# EAGLE design controller (EAGLE 6.5.0)
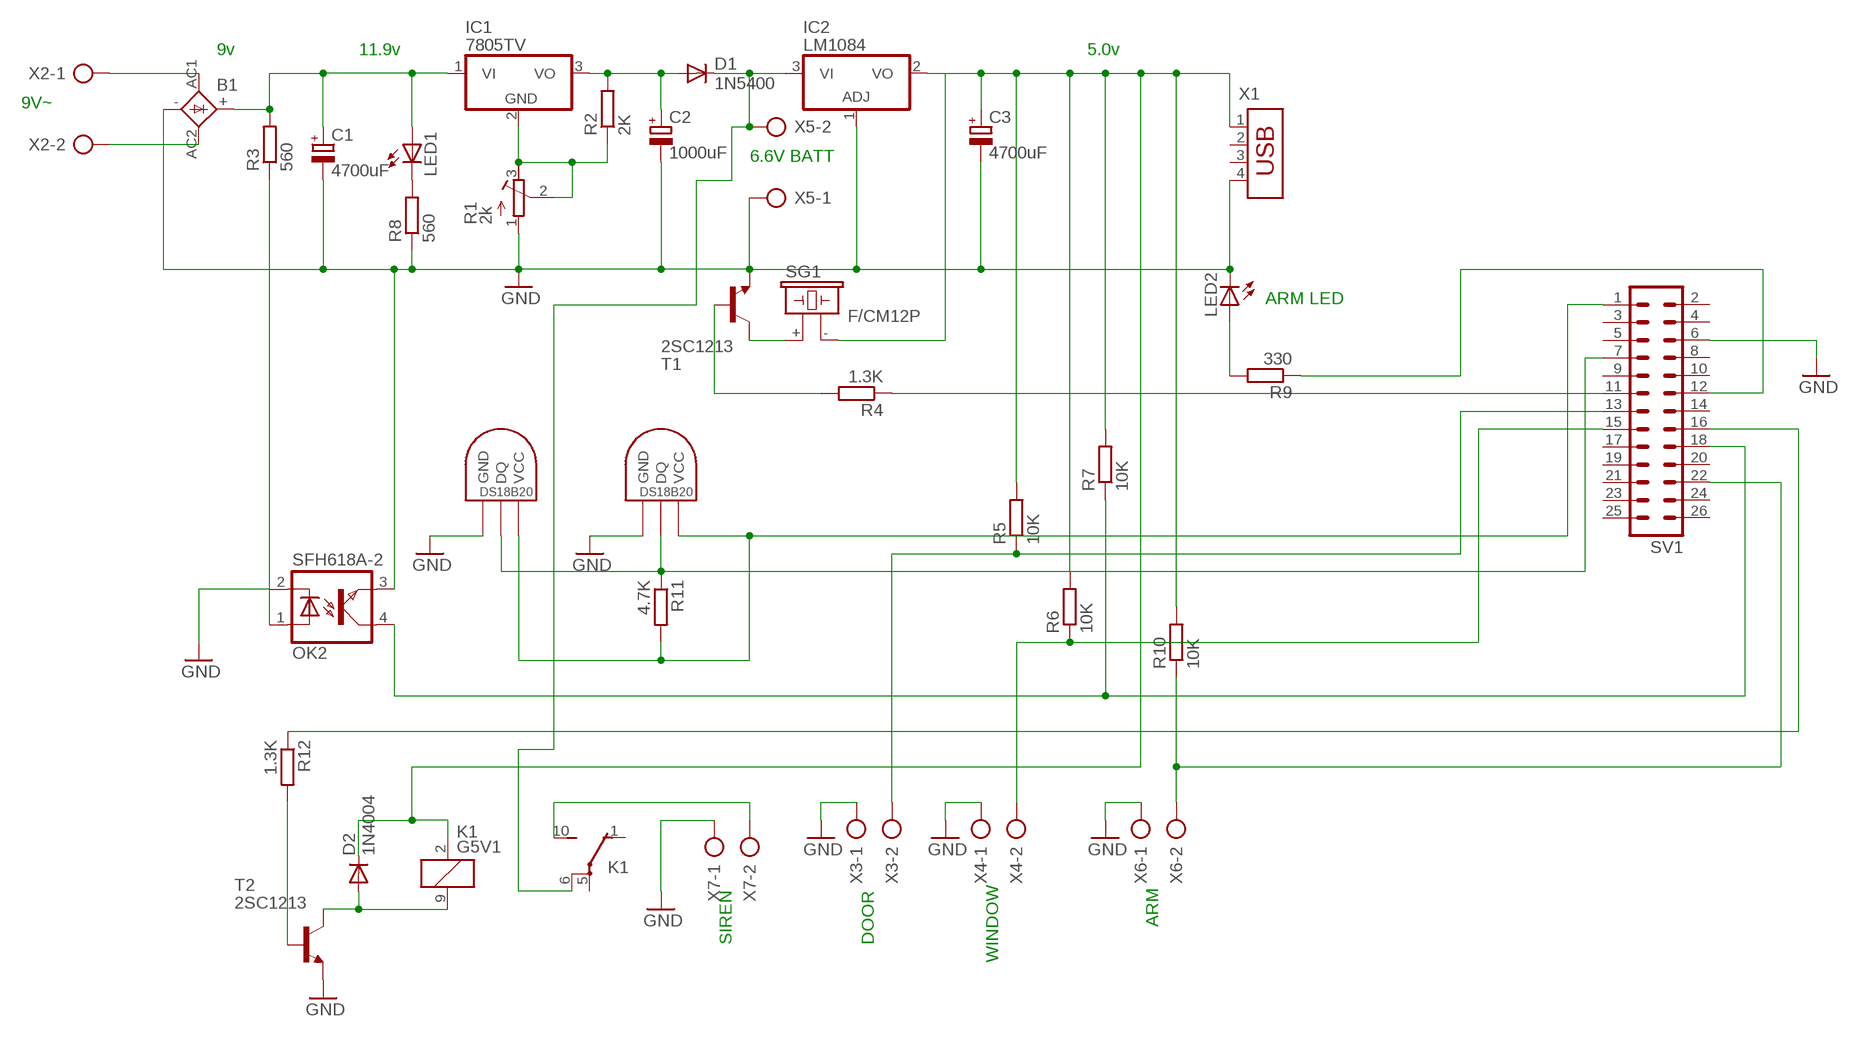
[diagram p0: schematic, sheet 1]

## Parts
B1  S41  [S41]
C1  4700uF  CPOL-EUE5-13  [E5-13]
C2  1000uF  CPOL-EUE5-10.5  [E5-10,5]
C3  4700uF  CPOL-EUE5-13  [E5-13]
D1  1N5400  [DO201-15]
D2  1N4004  [DO41-10]
IC1  7805TV  [TO220V]
IC2  LM1084  MC33269T-5.0  [TO220V]
K1  G5V1  [G5V1]
LED1  LED5MM  [LED5MM]
LED2  LED5MM  [LED5MM]
OK2  SFH618A-2  [DIP4]
R1  2k  R-TRIMM64W  [RTRIM64W]
R2  2K  R-EU_0204/7  [0204/7]
R3  560  R-EU_0204/7  [0204/7]
R4  1.3K  R-EU_0204/7  [0204/7]
R5  10K  R-EU_0204/7  [0204/7]
R6  10K  R-EU_0204/7  [0204/7]
R7  10K  R-EU_0204/7  [0204/7]
R8  560  R-EU_0204/7  [0204/7]
R9  330  R-EU_0204/7  [0204/7]
R10  10K  R-EU_0204/7  [0204/7]
R11  4.7K  R-EU_0204/7  [0204/7]
R12  1.3K  R-EU_0204/7  [0204/7]
SG1  F/CM12P  [F/CM12P]
SV1  ML26L  [ML26L]
T1  2SC1213  -NPN-TO92-EBC  [TO92-EBC]
T2  2SC1213  -NPN-TO92-EBC  [TO92-EBC]
U$1  DS1820TO92  [DS1820]
U$2  DS1820TO92  [DS1820]
X1  USB-787616  [USB]
X2  AK500/2  [AK500/2]
X3  AK500/2  [AK500/2]
X4  AK500/2  [AK500/2]
X5  AK500/2  [AK500/2]
X6  AK500/2  [AK500/2]
X7  AK500/2  [AK500/2]

## Nets
GND [fat]: B1.- C1.- C2.- C3.- IC2.1(ADJ) LED2.K(C) OK2.2(C) OK2.3(EMIT) R1.1(E) R8.1 SV1.6 T1.E T2.E U$1.GND U$2.GND X1.4 X3.1 X4.1 X5.1 X6.1 X7.1
N$1: IC1.2(GND) R1.2(S) R1.3(A) R2.1
N$2: R12.2 T2.B
N$3 [fat]: D2.A K1.9 T2.C
N$4 [fat]: C2.+ D1.A IC1.3(VO) R2.2
N$5 [fat]: B1.AC2 X2.2
N$6 [fat]: B1.AC1 X2.1
N$7 [fat]: B1.+ C1.+ IC1.1(VI) LED1.A R3.2
N$8: OK2.1(A) R3.1
N$9: OK2.4(COL) R7.1 SV1.18
N$10: R4.2 T1.B
N$11: R4.1 SV1.11
N$12: SG1.+ T1.C
N$13: R5.1 SV1.13 X3.2
N$14: LED1.K(C) R8.2
N$15: R6.1 SV1.15 X4.2
N$16: LED2.A R9.2
N$17: R9.1 SV1.12
N$18: R10.1 SV1.22 X6.2
N$19: R11.1 SV1.7 U$1.DQ U$2.DQ
N$20: R11.2 SV1.1 U$1.VDD(VCC) U$2.VDD(VCC)
N$21: R12.1 SV1.16
N$22 [fat]: C3.+ D2.C IC2.2(VO) K1.2 R5.2 R6.2 R7.2 R10.2 SG1.- X1.1
N$23: K1.10(2:S) X7.2
N$24 [fat]: D1.C IC2.3(VI) K1.6(2:P) X5.2
Unconnected: K1.1(2:O) K1.5(2:P) SV1.2 SV1.3 SV1.4 SV1.5 SV1.8 SV1.9 SV1.10 SV1.14 SV1.17 SV1.19 SV1.20 SV1.21 SV1.23 SV1.24 SV1.25 SV1.26 X1.2 X1.3

## Notes on the sheet
- 9v | 11.9v | 5.0v
- 9V~
- 6.6V BATT
- ARM LED
- ARM
- SIREN | DOOR
- WINDOW

## Library data of the parts
B1 = rectifier:S41: SEMIKRON RECTIFIER
C1-C3 = rcl:CPOL-EU: POLARIZED CAPACITOR, European symbol
D1 = diode:1N5400: DIODE standard rectifier, 3 A, 50 V (Motorola)
D2 = diode:1N4004: DIODE general purpose rectifier, 1 A
IC1 = linear:78*: Positive VOLTAGE REGULATOR Source: http://cache.national.com/ds/LM/LM78L05.pdf http://www.fairchildsemi.com/ds/LM/LM7805.pdf
IC2 = linear:MC33269?*: Adjustable Output Low Dropout Voltage Regulator 800 mA Source: http://www.onsemi.com/pub/Collateral/MC33269-D.PDF
K1 = relay:G5V1: RELAY 1 x switch, 0.5 A/125 V AC, 1 A/24 V DC , Omron; MPN: G5V-1-DC24; OC_FARNELL: 9949593; OC_NEWARK: 36M6377
LED1 LED2 = led:LED: LED OSRAM: - CHIPLED LG R971, LG N971, LY N971, LG Q971, LY Q971, LO R971, LY R971 LH N974, LH R974 LS Q976, LO Q976, LY Q976 LO Q996 - Hyper CHIPLED LW Q18S LB Q993, LB Q99A, LB R99A - SideLED LS A670, LO A670, LY A670, LG A670, LP A670 LB A673, LV A673, LT A673, LW A673 LH A674 LY A675 LS A676, LA A676, LO A676, LY A676, LW A676 LS A679, LY A679, LG A679 - Hyper Micro SIDELED® LS Y876, LA Y876, LO Y876, LY Y876 LT Y87S - SmartLED LW L88C, LW L88S LB L89C, LB L89S, LG L890 LS L89K, LO L89K, LY L89K LS L896, LA L896, LO L896, LY L896 - TOPLED LS T670, LO T670, LY T670, LG T670, LP T670 LSG T670, LSP T670, LSY T670, LOP T670, LYG T670 LG T671, LOG T671, LSG T671 LB T673, LV T673, LT T673, LW T673 LH T674 LS T676, LA T676, LO T676, LY T676, LB T676, LH T676, LSB T676, LW T676 LB T67C, LV T67C, LT T67C, LS T67K, LO T67K, LY T67K, LW E67C LS E67B, LA E67B, LO E67B, LY E67B, LB E67C, LV E67C, LT E67C LW T67C LS T679, LY T679, LG T679 LS T770, LO T770, LY T770, LG T770, LP T770 LB T773, LV T773, LT T773, LW T773 LH T774 LS E675, LA E675, LY E675, LS T675 LS T776, LA T776, LO T776, LY T776, LB T776 LHGB T686 LT T68C, LB T68C - Hyper Mini TOPLED® LB M676 - Mini TOPLED Santana® LG M470 LS M47K, LO M47K, LY M47K Source: http://www.osram.convergy.de LUXEON: - LUMILED® LXK2-PW12-R00, LXK2-PW12-S00, LXK2-PW14-U00, LXK2-PW14-V00 LXK2-PM12-R00, LXK2-PM12-S00, LXK2-PM14-U00 LXK2-PE12-Q00, LXK2-PE12-R00, LXK2-PE12-S00, LXK2-PE14-T00, LXK2-PE14-U00 LXK2-PB12-K00, LXK2-PB12-L00, LXK2-PB12-M00, LXK2-PB14-N00, LXK2-PB14-P00, LXK2-PB14-Q00 LXK2-PR12-L00, LXK2-PR12-M00, LXK2-PR14-Q00, LXK2-PR14-R00 LXK2-PD12-Q00, LXK2-PD12-R00, LXK2-PD12-S00 LXK2-PH12-R00, LXK2-PH12-S00 LXK2-PL12-P00, LXK2-PL12-Q00, LXK2-PL12-R00 Source: www.luxeon.com KINGBRIGHT: KA-3528ASYC Source: www.kingbright.com
OK2 = optocoupler:SFH618?*: Optocoupler, Phototransistor Output, Low Input Current Source: Data sheet <http://www.vishay.com/docs/83673/sfh618.pdf>; MF: VISHAY/TELEFUNKEN; MPN: SFH618A-2; OC_FARNELL: 6424855; OC_NEWARK: 21H7744
R1 = resistor:R-TRIMM: Trimm resistor
R2-R12 = resistor:R-EU_: RESISTOR, European symbol
SG1 = buzzer:F/CM12P: BUZZER Source: Buerklin; OC_FARNELL: unknown; OC_NEWARK: unknown
SV1 = con-ml:ML26L: HARTING; OC_FARNELL: unknown; OC_NEWARK: unknown
T1 T2 = transistor:*-NPN-: NPN Transistror BF959 corrected 2008.03.06
U$1 U$2 = Ava:DS1820: DS18B20 Programmable Resolution 1-Wire Digital Thermometer Description The DS18B20 digital thermometer provides 9-bit to 12-bit Celsius temperature measurements and has an alarm function with nonvolatile user-programmable upper and lower trigger points. The DS18B20 communicates over a 1-Wire® bus that by definition requires only one data line (and ground) for communication with a central microprocessor. It has an operating temperature range of -55°C to +125°C and is accurate to ±0.5°C over the range of -10°C to +85°C. In addition, the DS18B20 can derive power directly from the data line ("parasite power"), eliminating the need for an external power supply. Each DS18B20 has a unique 64-bit serial code, which allows multiple DS18B20s to function on the same 1-Wire bus. Thus, it is simple to use one microprocessor to control many DS18B20s distributed over a large area. Applications that can benefit from this feature include HVAC environmental controls, temperature monitoring systems inside buildings, equipment, or machinery, and process monitoring and control systems.
X1 = con-amp:USB-787616: AMP connector
X2-X7 = con-ptr500:AK500/2: CONNECTOR; OC_FARNELL: unknown; OC_NEWARK: unknown

## Net classes
0 default: width 1 mm
1 Ground: width 1 mm
2 fat: width 2 mm

## Board
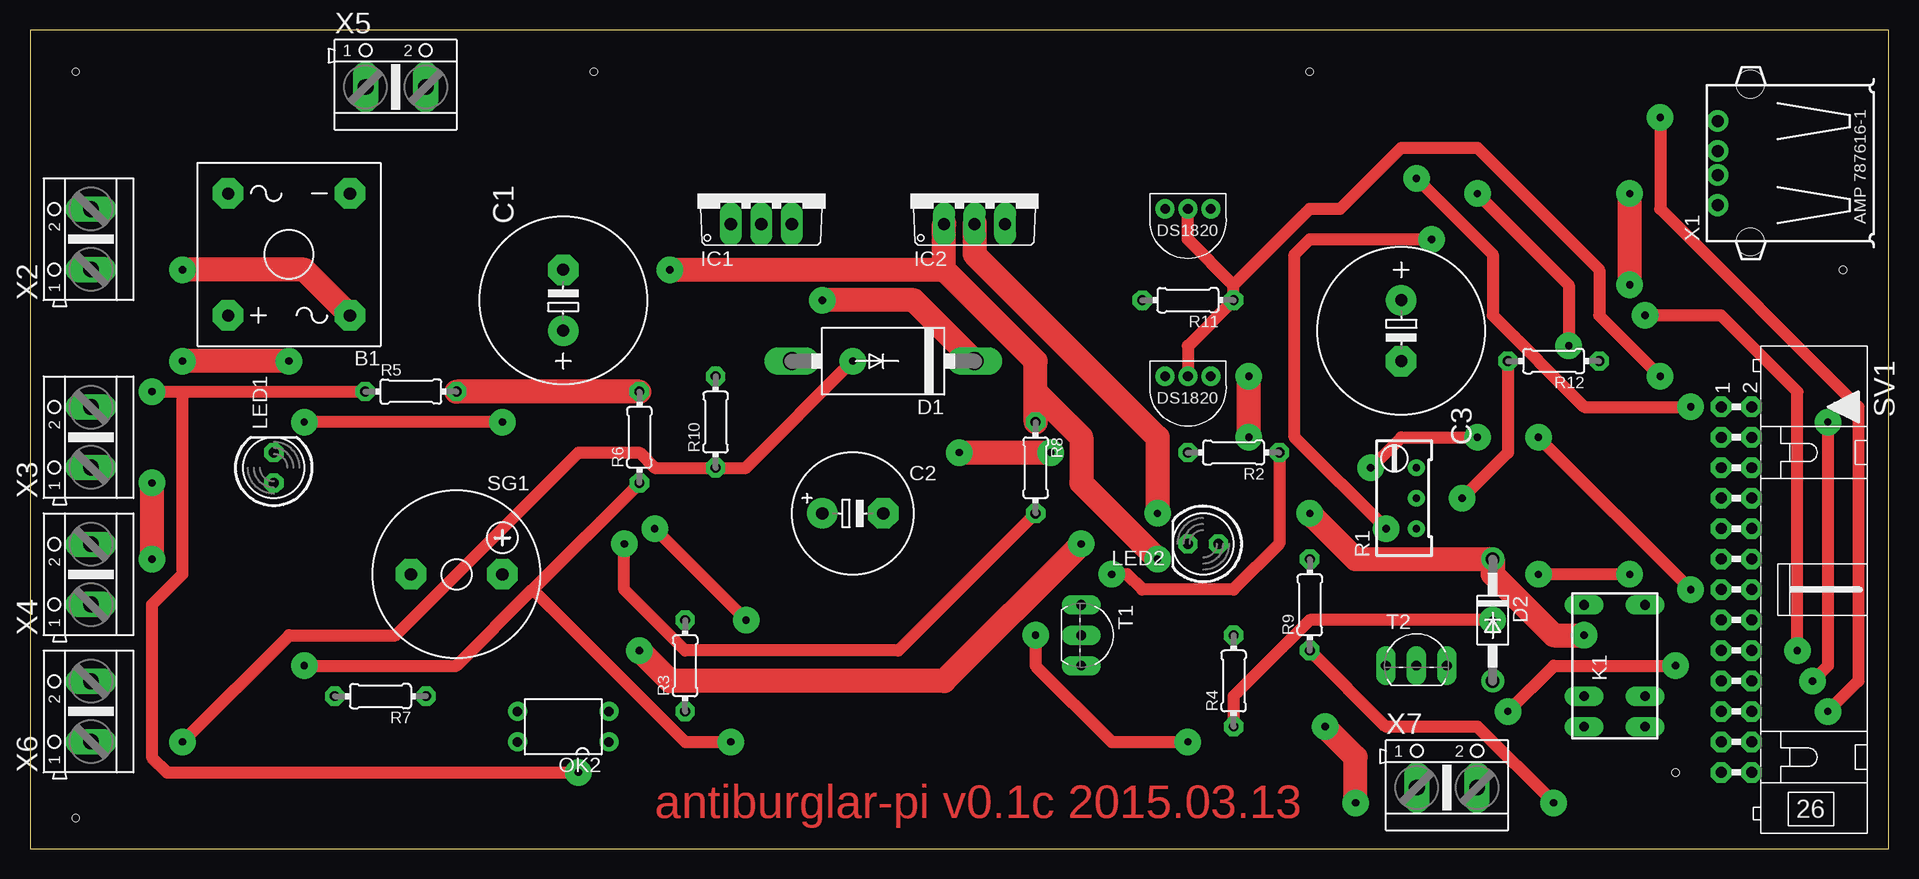
[diagram p1: board, top side]
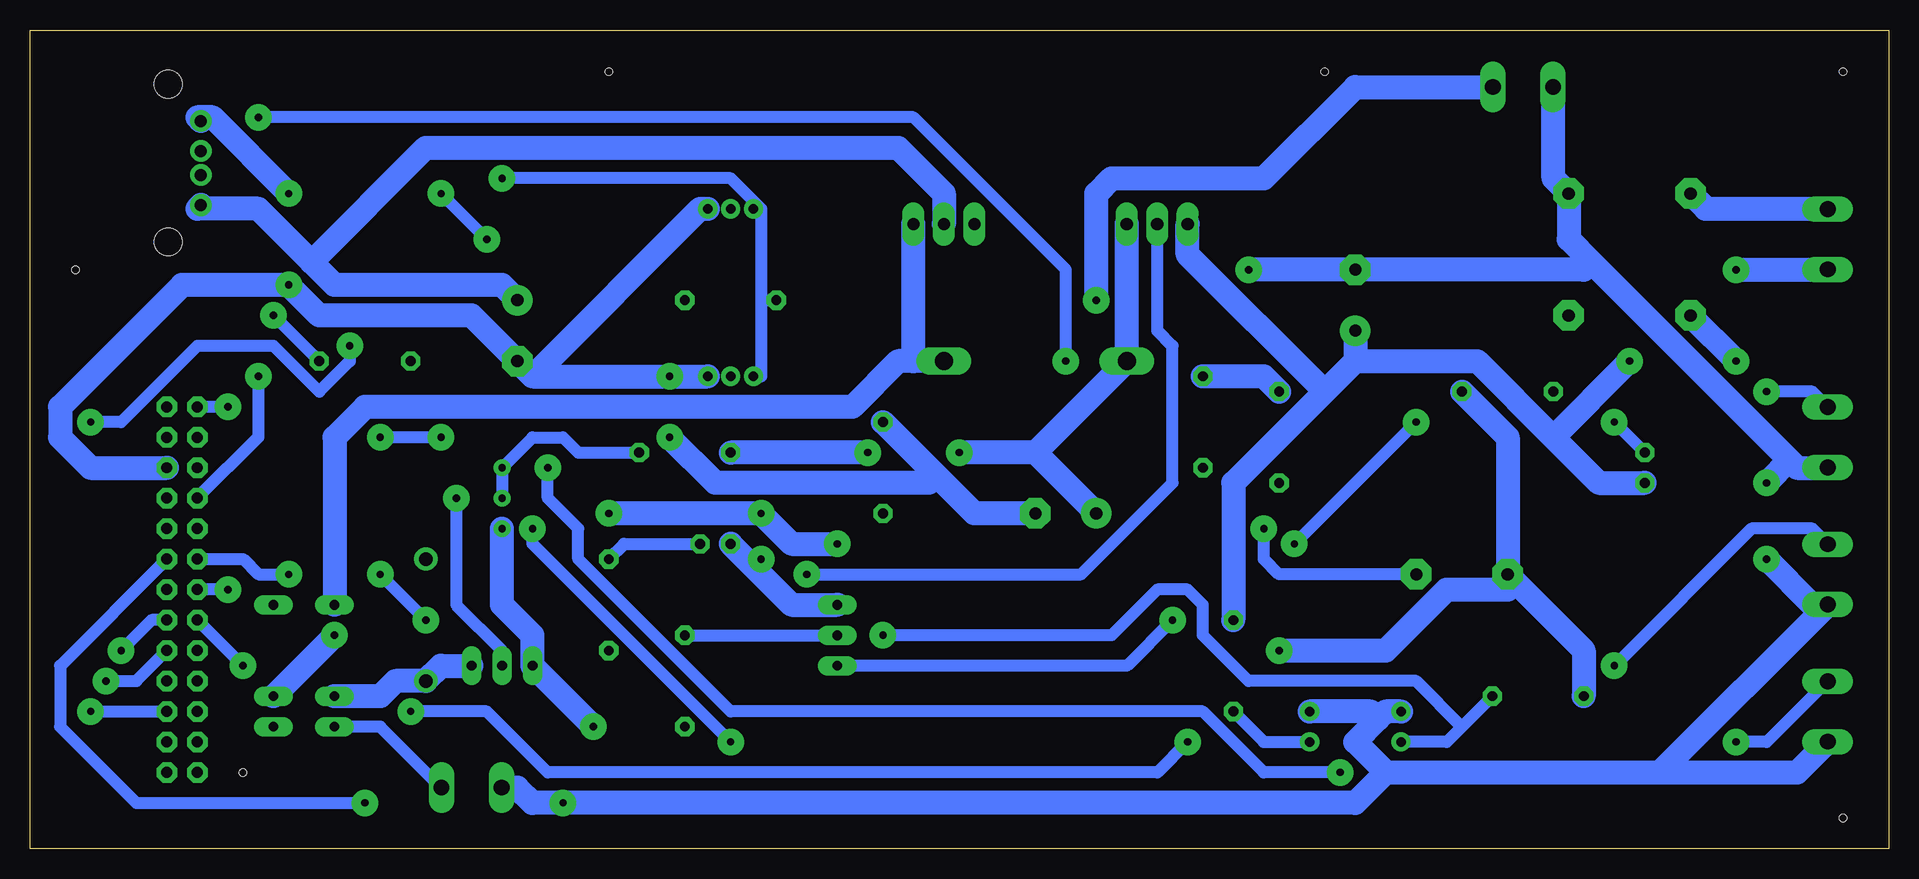
[diagram p2: board, bottom side, seen from below]

Size 154.92 x 68.25 mm. Coordinates in mm from the lower left corner, seen from the top.
Outline: 0,0 154.92,0 154.92,68.25 0,68.25 0,0
Copper layers (1*16): Top 0.035mm / dielectric 1.5mm / Bottom 0.035mm
Design rules "default *": minimum track width 10mil, minimum drill 24mil, track to track 16mil, track to pad 16mil, pad to pad 16mil, via to via 16mil, smd to smd 8mil, copper to edge 40mil, drill to drill 8mil, minimum pad ring 0.4mm, minimum via ring 0.8mm, stop-mask expansion 4mil, vias tented up to drill 0mil, thermal gap 10mil
Holes 0.6 mm at 3.81,64.77 3.81,2.54 151.13,48.26 137.16,6.35 46.99,64.77 106.68,64.77
tRestrict: area 24.1,61 to 38.1,66; area 17.8,29.2 to 22.9,34.3; area 95.2,22.9 to 100.3,27.9; area 139.7,2.5 to 146.1,38.1; area 86.4,14 to 90.2,21.6; area 114.3,25.4 to 116.8,33; area 97.8,38.1 to 100.3,40.6; area 15.2,53.3 to 17.8,55.9; area 25.4,53.3 to 27.9,55.9; area 15.2,43.2 to 17.8,45.7; area 43.2,47 to 45.7,49.5; area 43.2,41.9 to 45.7,44.4; 31 more areas

### Footprints (pad centres in the part's own frame; a part is rotated, then mirrored left to right if it is on the bottom)
S41 = drill 1.016 pad 2.54 octagon: + 5.08,5.08; - -5.08,-5.08; AC1 -5.08,5.08; AC2 5.08,-5.08
E5-13 = drill 1.016 pad 2.54: + -2.54,0 | drill 1.016 pad 2.54 octagon: - 2.54,0
E5-10,5 = drill 1.016 pad 2.54: + -2.54,0 | drill 1.016 pad 2.54 octagon: - 2.54,0
DO201-15 = drill 1.499 long: A 7.62,0; C -7.62,0
DO41-10 = drill 1.118: A 5.08,0; C -5.08,0
TO220V = drill 1.016 long: 1 -2.54,-2.54; 2 0,-2.54; 3 2.54,-2.54
G5V1 = drill 0.813 long: 1 -5.08,-2.54; 2 -2.54,-2.54; 5 5.08,-2.54; 6 5.08,2.54; 9 -2.54,2.54; 10 -5.08,2.54
LED5MM = drill 0.813 octagon: A -1.27,0; K 1.27,0
DIP4 = drill 0.8: 1 -1.27,-3.81; 2 1.27,-3.81; 3 1.27,3.81; 4 -1.27,3.81
RTRIM64W = drill 0.61: 1 1.27,-2.54; 2 1.27,0; 3 1.27,2.54
0204/7 = drill 0.813 octagon: 1 -3.81,0; 2 3.81,0
F/CM12P = drill 1.016 pad 2.54 octagon: + 3.81,0; - -3.81,0
ML26L = drill 0.914 octagon: 1 -15.24,-1.27; 2 -15.24,1.27; 3 -12.7,-1.27; 4 -12.7,1.27; 5 -10.16,-1.27; 6 -10.16,1.27; 7 -7.62,-1.27; 8 -7.62,1.27; 9 -5.08,-1.27; 10 -5.08,1.27; 11 -2.54,-1.27; 12 -2.54,1.27; 13 0,-1.27; 14 0,1.27; 15 2.54,-1.27; 16 2.54,1.27; 17 5.08,-1.27; 18 5.08,1.27; 19 7.62,-1.27; 20 7.62,1.27; 21 10.16,-1.27; 22 10.16,1.27; 23 12.7,-1.27; 24 12.7,1.27; 25 15.24,-1.27; 26 15.24,1.27
TO92-EBC = drill 0.813 long: B 0,-1.27; C 2.54,-1.27; E -2.54,-1.27
DS1820 = drill 0.8: DQ 2.54,-1.27; GND 0.635,-1.27; VDD 4.445,-1.27
USB = drill 1: 1 -3.5,12.99; 2 -1,12.99; 3 1,12.99; 4 3.5,12.99 | hole 2.3: -6.57,10.28; 6.57,10.28
AK500/2 = drill 1.321 long: 1 -2.515,0; 2 2.515,0

### Placement (x,y rotation side)
B1  21.59,49.53 180 top
C1  44.45,45.72 90 top
C2  68.58,27.94 0 top
C3  114.3,43.18 270 top
D1  71.12,40.64 180 top
D2  121.92,19.05 270 top
IC1  60.96,54.61 0 top
IC2  78.74,54.61 0 top
K1  132.08,15.24 90 top
LED1  20.32,31.75 90 top
LED2  97.79,25.4 180 top
OK2  44.45,10.16 90 top
R1  114.3,29.21 0 top
R2  100.33,33.02 180 top
R3  54.61,15.24 90 top
R4  100.33,13.97 90 top
R5  31.75,38.1 0 top
R6  50.8,34.29 90 top
R7  29.21,12.7 180 top
R8  83.82,31.75 270 top
R9  106.68,20.32 90 top
R10  57.15,35.56 90 top
R11  96.52,45.72 180 top
R12  127,40.64 180 top
SG1  35.56,22.86 0 top
SV1  142.24,21.59 270 top
T1  88.9,17.78 270 top
T2  115.57,16.51 0 top
U$1  99.06,38.1 180 top
U$2  99.06,52.07 180 top
X1  153.67,57.15 90 top
X2  5.08,50.8 90 top
X3  5.08,34.29 90 top
X4  5.08,22.86 90 top
X5  30.48,63.5 0 top
X6  5.08,11.43 90 top
X7  118.11,5.08 0 top

### Tracks (layer width: path | path; a pad name or v marks a point on that pad's centre or on a via)
GND  (via drill 0.61)
  Top 2: v107.95,10.16 110.49,7.62 v110.49,3.81 | v133.35,46.99 v133.35,54.61 | 76.2,48.26 IC2.1 | 76.2,48.26 83.82,40.64 83.82,38.1 | R8.1 83.82,38.1 | v93.98,24.13 87.63,30.48 87.63,34.29 83.82,38.1 | v53.34,48.26 76.2,48.26 | v101.6,34.29 v101.6,39.37 | v10.16,30.48 v10.16,24.13
  Bottom 2: R1.1 115.57,20.32 113.03,17.78 T2.E v107.95,10.16 | 42.55,10.8 41.91,11.43 OK2.3 | 42.55,10.8 44.45,8.89 41.91,6.35 | 41.91,6.35 19.05,6.35 | 19.05,6.35 7.62,6.35 5.08,8.89 X6.1 | 19.05,6.35 5.08,20.32 X4.1 6.35,20.32 v10.16,24.13 | X7.1 114.3,5.08 113.03,3.81 v110.49,3.81 44.45,3.81 41.91,6.35 | 113.03,39.37 v101.6,39.37 U$1.GND | 113.03,39.37 C3.- 118.11,44.45 130.81,44.45 v133.35,46.99 142.24,46.99 152.4,36.83 152.4,34.29 149.86,31.75 SV1.6 | 113.03,39.37 99.06,53.34 U$2.GND | v133.35,54.61 139.7,60.96 140.97,60.96 X1.4 | T1.E 91.44,20.32 94.61,23.49 | LED2.K 94.61,23.49 | 79.38,31.12 76.2,27.94 C2.- | 79.38,31.12 R8.1 | v93.98,24.13 94.61,23.49 | 24.77,48.9 26.67,50.8 B1.- 27.94,55.88 27.94,63.5 X5.1 | 24.77,48.9 8.26,32.38 | 8.26,32.38 7.62,31.75 5.08,31.75 X3.1 | 24.77,48.9 25.4,48.26 C1.- v53.34,48.26 | v101.6,34.29 97.79,30.48 80.01,30.48 79.38,31.12 | 8.26,32.38 v10.16,30.48 | OK2.2 43.18,11.43 42.55,10.8
N$1  (via drill 0.61)
  Top 1: v90.17,22.86 91.44,22.86 92.71,21.59 100.33,21.59 104.14,25.4 R2.1
  Bottom 1: R1.2 R1.3 113.03,34.29 110.49,34.29 109.22,33.02 R2.1 | IC1.2 60.96,43.18 59.69,41.91 59.69,30.48 67.31,22.86 v90.17,22.86
N$2  (via drill 0.61)
  Top 1: v119.38,29.21 123.19,33.02 R12.2
  Bottom 1: T2.B 115.57,16.51 119.38,20.32 v119.38,29.21
N$3
  Bottom 2: T2.C 120.65,15.24 D2.A 124.46,13.97 125.73,12.7 K1.9
N$4  (via drill 0.61)
  Top 2: v77.47,33.02 v85.09,33.02
  Bottom 2: IC1.3 D1.A 71.12,33.02 | v85.09,33.02 R2.2 | 71.12,33.02 v77.47,33.02 | C2.+ 71.12,33.02
N$5
  Bottom 2: B1.AC2 15.24,53.34 5.08,53.34 X2.2
N$6  (via drill 0.61)
  Top 2: v12.7,48.26 22.86,48.26 B1.AC1
  Bottom 2: v12.7,48.26 5.08,48.26 X2.1
N$7  (via drill 0.61)
  Top 2: v21.59,40.64 v12.7,40.64
  Bottom 2: R3.2 54.61,30.48 46.99,38.1 | 44.45,40.64 46.99,38.1 | C1.+ 44.45,40.64 | LED1.A 24.13,30.48 27.94,34.29 | 27.94,34.29 34.29,40.64 44.45,40.64 | IC1.1 58.42,49.53 46.99,38.1 | v12.7,40.64 B1.+ | 27.94,34.29 v21.59,40.64
N$8
  Bottom 1: OK2.1 52.07,8.89 R3.1
N$9  (via drill 0.61)
  Top 1: v148.59,13.97 149.86,15.24 v149.86,35.56 | v128.27,41.91 128.27,46.99 v120.65,54.61 | v116.84,50.8 106.68,50.8 105.41,49.53 105.41,34.29 v113.03,26.67 | v96.52,8.89 90.17,8.89 83.82,15.24 v83.82,17.78
  Bottom 1: OK2.4 36.83,8.89 35.56,10.16 | R7.1 35.56,10.16 | SV1.18 146.05,13.97 v148.59,13.97 | v149.86,35.56 147.32,35.56 140.97,41.91 134.62,41.91 130.81,38.1 128.27,40.64 v128.27,41.91 | v116.84,50.8 v120.65,54.61 | v113.03,26.67 113.03,25.4 v96.52,8.89 | v83.82,17.78 64.77,17.78 60.96,21.59 58.42,21.59 57.15,20.32 57.15,17.78 53.34,13.97 39.37,13.97 35.56,10.16
N$10
  Bottom 1: R4.2 T1.B
N$11  (via drill 0.61)
  Top 1: R4.1 100.33,12.7 106.68,19.05 v121.92,19.05 | v133.35,22.86 v125.73,22.86
  Bottom 1: v125.73,22.86 v121.92,19.05 | v133.35,22.86 135.89,22.86 137.16,24.13 SV1.11
N$12  (via drill 0.61)
  Top 1: v52.07,26.67 v59.69,19.05
  Bottom 1: T1.C 63.5,15.24 v59.69,19.05 | v52.07,26.67 52.07,24.13 50.8,22.86 SG1.+
N$13  (via drill 0.61)
  Top 1: v10.16,38.1 12.7,38.1 | 12.7,38.1 R5.1 | v125.73,34.29 v138.43,21.59 | v120.65,34.29 114.3,34.29 v111.76,31.75 | v45.72,6.35 11.43,6.35 10.16,7.62 10.16,20.32 12.7,22.86 12.7,38.1
  Bottom 1: v10.16,38.1 6.35,38.1 5.08,36.83 X3.2 | v138.43,21.59 SV1.13 | v120.65,34.29 v125.73,34.29 | v111.76,31.75 111.76,29.21 109.22,26.67 109.22,24.13 96.52,11.43 57.15,11.43 52.07,6.35 v45.72,6.35
N$14  (via drill 0.61)
  Top 1: v39.37,35.56 v22.86,35.56 | v49.53,25.4 49.53,21.59 54.61,16.51 72.39,16.51 R8.2
  Bottom 1: v22.86,35.56 LED1.K | v49.53,25.4 v39.37,35.56
N$15  (via drill 0.61)
  Top 1: 41.91,21.59 35.56,15.24 v22.86,15.24 | 41.91,21.59 R6.1 | v137.16,15.24 127,15.24 v123.19,11.43 | v58.42,8.89 54.61,8.89 41.91,21.59
  Bottom 1: v22.86,15.24 11.43,26.67 6.35,26.67 5.08,25.4 X4.2 | v137.16,15.24 SV1.15 | v123.19,11.43 116.84,11.43 111.76,6.35 60.96,6.35 v58.42,8.89
N$16
  Bottom 1: LED2.A 105.41,25.4 R9.2
N$17  (via drill 0.61)
  Top 1: R9.1 113.03,10.16 120.65,10.16 v127,3.81
  Bottom 1: v127,3.81 146.05,3.81 152.4,10.16 152.4,15.24 SV1.12
N$18  (via drill 0.61)
  Top 1: v12.7,8.89 21.59,17.78 30.48,17.78 45.72,33.02 50.8,33.02 52.07,31.75 R10.1 59.69,31.75 v68.58,40.64 | v149.86,11.43 152.4,13.97 152.4,36.83 135.89,53.34 v135.89,60.96
  Bottom 1: v12.7,8.89 10.16,8.89 5.08,13.97 X6.2 | v149.86,11.43 SV1.22 | v135.89,60.96 81.28,60.96 68.58,48.26 v68.58,40.64
N$19  (via drill 0.61)
  Top 1: U$1.DQ 96.52,41.91 R11.1 100.33,46.99 | U$2.DQ 96.52,50.8 100.33,46.99 | v135.89,39.37 130.81,44.45 130.81,48.26 120.65,58.42 114.3,58.42 109.22,53.34 106.68,53.34 100.33,46.99
  Bottom 1: SV1.7 135.89,34.29 v135.89,39.37
N$20  (via drill 0.61)
  Top 1: v138.43,36.83 129.54,36.83 121.92,44.45 121.92,49.53 v115.57,55.88
  Bottom 1: 93.98,53.34 93.98,45.72 | 93.98,45.72 93.98,39.37 U$1.VDD | 93.98,45.72 R11.2 | v138.43,36.83 SV1.1 | v115.57,55.88 96.52,55.88 93.98,53.34 | 93.98,53.34 U$2.VDD
N$21  (via drill 0.61)
  Top 1: v134.62,44.45 140.97,44.45 147.32,38.1 v147.32,16.51
  Bottom 1: v134.62,44.45 R12.1 | v147.32,16.51 144.78,19.05 SV1.16
N$22  (via drill 0.61)
  Top 2: R6.2 R5.2 | v129.54,17.78 127,17.78 121.92,22.86 D2.C 110.49,24.13 v106.68,27.94 | v93.98,27.94 93.98,34.29 78.74,49.53 IC2.2 | v50.8,16.51 53.34,13.97 76.2,13.97 v87.63,25.4
  Bottom 2: R7.2 25.4,16.51 31.11,22.23 | 31.11,22.23 SG1.- 31.75,34.29 R5.2 | R10.2 52.07,39.37 R6.2 | v129.54,17.78 K1.2 | 131.44,48.9 129.54,46.99 115.57,46.99 C3.+ | 131.44,48.9 135.89,53.34 140.97,53.34 X1.1 | IC2.2 78.74,54.61 82.55,58.42 121.92,58.42 131.44,48.9 | v106.68,27.94 v93.98,27.94 91.44,25.4 v87.63,25.4 | v50.8,16.51 41.91,16.51 36.83,21.59 31.75,21.59 31.11,22.23
N$23
  Bottom 1: K1.10 125.73,10.16 120.65,5.08 X7.2
N$24  (via drill 0.61)
  Top 2: v66.04,45.72 73.66,45.72 D1.C
  Bottom 2: K1.6 129.54,34.29 127,36.83 86.36,36.83 82.55,40.64 81.28,40.64 | D1.C 81.28,40.64 | 81.28,40.64 IC2.3 | X5.2 44.45,63.5 52.07,55.88 64.77,55.88 66.04,54.61 v66.04,45.72

### Text on the board
Top: antiburglar-pi v0.1c 2015.03.13